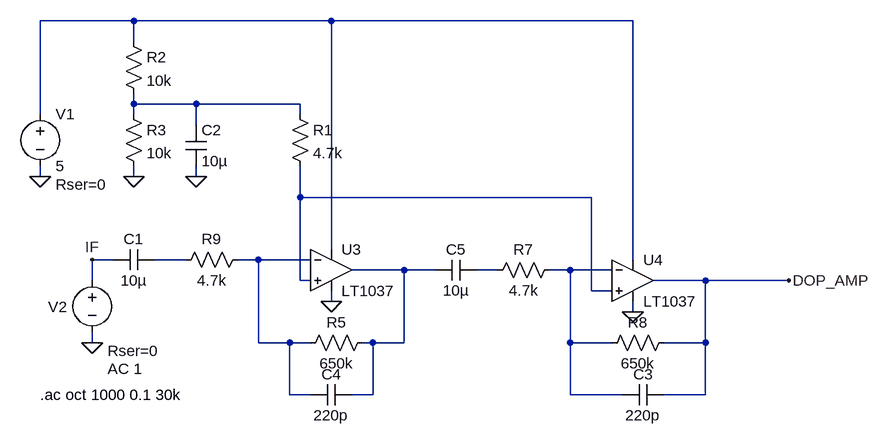
[diagram p0: schematic cdm324-limpkin.asc]
cdm324-limpkin.asc, the LTspice schematic file:
Version 4
SHEET 1 888 680
WIRE -272 -144 -416 -144
WIRE 32 -144 -272 -144
WIRE 496 -144 32 -144
WIRE -272 -112 -272 -144
WIRE -272 -16 -272 -32
WIRE -176 -16 -272 -16
WIRE -16 -16 -176 -16
WIRE -416 0 -416 -144
WIRE -272 0 -272 -16
WIRE -16 0 -16 -16
WIRE -176 16 -176 -16
WIRE -416 96 -416 80
WIRE -272 96 -272 80
WIRE -176 96 -176 80
WIRE -16 128 -16 80
WIRE 432 128 -16 128
WIRE 32 208 32 -144
WIRE -304 224 -336 224
WIRE -192 224 -240 224
WIRE -80 224 -112 224
WIRE 0 224 -80 224
WIRE 496 224 496 -144
WIRE 144 240 64 240
WIRE 192 240 144 240
WIRE 288 240 256 240
WIRE 400 240 368 240
WIRE 464 240 400 240
WIRE -336 256 -336 224
WIRE -16 256 -16 128
WIRE 0 256 -16 256
WIRE 608 256 528 256
WIRE 736 256 608 256
WIRE 432 272 432 128
WIRE 464 272 432 272
WIRE 32 288 32 272
WIRE 496 304 496 288
WIRE -336 352 -336 336
WIRE -80 352 -80 224
WIRE -32 352 -80 352
WIRE 0 352 -32 352
WIRE 96 352 80 352
WIRE 144 352 144 240
WIRE 144 352 96 352
WIRE 400 352 400 240
WIRE 464 352 400 352
WIRE 608 352 608 256
WIRE 608 352 544 352
WIRE -32 432 -32 352
WIRE 0 432 -32 432
WIRE 96 432 96 352
WIRE 96 432 64 432
WIRE 400 432 400 352
WIRE 480 432 400 432
WIRE 608 432 608 352
WIRE 608 432 544 432
FLAG -416 96 0
FLAG -272 96 0
FLAG -176 96 0
FLAG -336 224 IF
FLAG 32 288 0
FLAG 496 304 0
FLAG 736 256 DOP_AMP
FLAG -336 352 0
SYMBOL voltage -416 -16 R0
WINDOW 123 0 0 Left 2
WINDOW 39 24 124 Left 2
SYMATTR SpiceLine Rser=0
SYMATTR InstName V1
SYMATTR Value 5
SYMBOL cap -240 208 R90
WINDOW 0 0 32 VBottom 2
WINDOW 3 32 32 VTop 2
SYMATTR InstName C1
SYMATTR Value 10µ
SYMBOL res -288 -128 R0
SYMATTR InstName R2
SYMATTR Value 10k
SYMBOL res -288 -16 R0
SYMATTR InstName R3
SYMATTR Value 10k
SYMBOL cap -192 16 R0
SYMATTR InstName C2
SYMATTR Value 10µ
SYMBOL res 96 336 R90
WINDOW 0 0 56 VBottom 2
WINDOW 3 32 56 VTop 2
SYMATTR InstName R5
SYMATTR Value 650k
SYMBOL cap 64 416 R90
WINDOW 0 0 32 VBottom 2
WINDOW 3 32 32 VTop 2
SYMATTR InstName C4
SYMATTR Value 220p
SYMBOL cap 256 224 R90
WINDOW 0 0 32 VBottom 2
WINDOW 3 32 32 VTop 2
SYMATTR InstName C5
SYMATTR Value 10µ
SYMBOL res 384 224 R90
WINDOW 0 0 56 VBottom 2
WINDOW 3 32 56 VTop 2
SYMATTR InstName R7
SYMATTR Value 4.7k
SYMBOL res 560 336 R90
WINDOW 0 0 56 VBottom 2
WINDOW 3 32 56 VTop 2
SYMATTR InstName R8
SYMATTR Value 650k
SYMBOL voltage -336 240 R0
WINDOW 123 24 152 Left 2
WINDOW 39 24 124 Left 2
WINDOW 0 -68 57 Left 2
SYMATTR Value2 AC 1
SYMATTR SpiceLine Rser=0
SYMATTR InstName V2
SYMATTR Value ""
SYMBOL Opamps\\LT1037 32 176 R0
SYMATTR InstName U3
SYMBOL Opamps\\LT1037 496 192 R0
SYMATTR InstName U4
SYMBOL res -96 208 R90
WINDOW 0 0 56 VBottom 2
WINDOW 3 32 56 VTop 2
SYMATTR InstName R9
SYMATTR Value 4.7k
SYMBOL res -32 -16 R0
SYMATTR InstName R1
SYMATTR Value 4.7k
SYMBOL cap 544 416 R90
WINDOW 0 0 32 VBottom 2
WINDOW 3 32 32 VTop 2
SYMATTR InstName C3
SYMATTR Value 220p
TEXT -416 432 Left 2 !.ac oct 1000 0.1 30k

The netlist it stands for:
* cdm324-limpkin.asc
V1 N001 0 5 Rser=0
C1 N004 IF 10µ
R2 N001 N002 10k
R3 N002 0 10k
C2 N002 0 10µ
R5 N006 N005 650k
C4 N006 N005 220p
C5 N007 N006 10µ
R7 N008 N007 4.7k
R8 DOP_AMP N008 650k
V2 IF 0 AC 1 Rser=0
XU3 N003 N005 N001 0 N006 LT1037  ; pins In+ In- V+ V- OUT
XU4 N003 N008 N001 0 DOP_AMP LT1037  ; pins In+ In- V+ V- OUT
R9 N005 N004 4.7k
R1 N002 N003 4.7k
C3 DOP_AMP N008 220p
.ac oct 1000 0.1 30k
.backanno
.end